# Altium schematic sheet StepperController.SchDoc
size A4
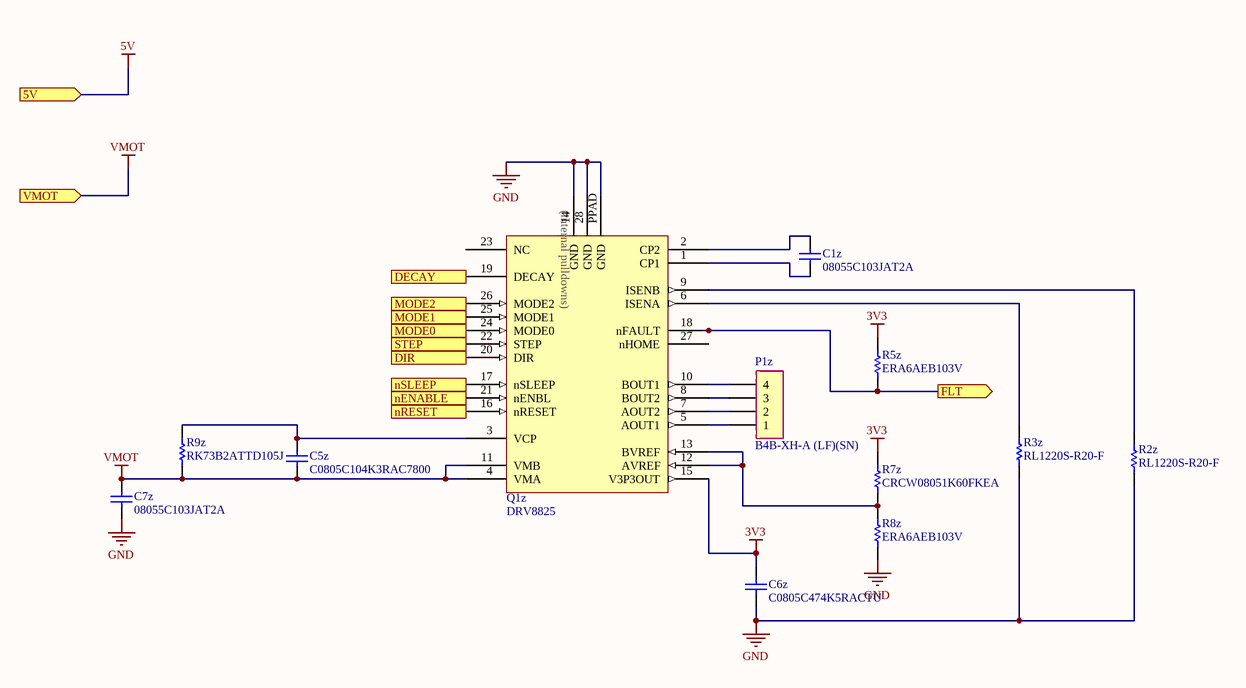
[diagram p0: StepperController.SchDoc]

## Parts
C1z  08055C103JAT2A  [CAPC2013X94X50ML20T25]
C5z  C0805C104K3RAC7800  [CAPC2013X145X50ML20T25]
C6z  C0805C474K5RACTU  [CAPC2013X110X50NL20T25]
C7z  08055C103JAT2A  [CAPC2013X94X50ML20T25]
P1z  B4B-XH-A (LF)(SN)  [B4B-XH-A (LF)(SN)]
Q1z  DRV8825  [DRV8825 HTSSOP]
R2z  RL1220S-R20-F  [RESC2013X50X40ML20T20]
R3z  RL1220S-R20-F  [RESC2013X50X40ML20T20]
R5z  ERA6AEB103V  [RESC2013X60X40ML20T25]
R7z  CRCW08051K60FKEA  [RESC2013X50X30NL20T20]
R8z  ERA6AEB103V  [RESC2013X60X40ML20T25]
R9z  RK73B2ATTD105J  [RESC2013X60X30NL20T20]

## Ports
5V (in), DECAY (in), DIR (in), FLT (out), MODE0 (in), MODE1 (in), MODE2 (in), nENABLE (in), nRESET (in), nSLEEP (in), STEP (in), VMOT (in)

## Nets
3V3: C6z.2 Q1z.15(V3P3OUT) R5z.1 R7z.2
5V: port 5V
GND: C6z.1 C7z.1 Q1z.14(GND) Q1z.28(GND) Q1z.PPAD(GND) R2z.1 R3z.1 R8z.1
VMOT: C5z.2 C7z.2 Q1z.4(VMA) Q1z.11(VMB) R9z.1 ; port VMOT
DECAY: Q1z.19(DECAY) ; port DECAY
DIR: Q1z.20(DIR) ; port DIR
FLT: Q1z.18(nFAULT) R5z.2 ; port FLT
MODE0: Q1z.24(MODE0) ; port MODE0
MODE1: Q1z.25(MODE1) ; port MODE1
MODE2: Q1z.26(MODE2) ; port MODE2
nENABLE: Q1z.21(nENBL) ; port nENABLE
nRESET: Q1z.16(nRESET) ; port nRESET
nSLEEP: Q1z.17(nSLEEP) ; port nSLEEP
STEP: Q1z.22(STEP) ; port STEP
NetC1z_1: C1z.1 Q1z.1(CP1)
NetC1z_2: C1z.2 Q1z.2(CP2)
NetC5z_1: C5z.1 Q1z.3(VCP) R9z.2
NetP1z_1: P1z.1 Q1z.5(AOUT1)
NetP1z_2: P1z.2 Q1z.7(AOUT2)
NetP1z_3: P1z.3 Q1z.8(BOUT2)
NetP1z_4: P1z.4 Q1z.10(BOUT1)
NetQ1z_6: Q1z.6(ISENA) R3z.2
NetQ1z_9: Q1z.9(ISENB) R2z.2
NetQ1z_12: Q1z.12(AVREF) Q1z.13(BVREF) R7z.1 R8z.2

Not connected (* = marked no-connect by the designer): Q1z 23(NC) 27(nHOME)

## Notes on the sheet
- Date:
- Sheet
- of
- Time:
- Revision:
- Drawn by:
- File:
- (in symbol Stepper motor driver DRV8825) (internal pulldowns)

## Library data of the parts
C1z C7z = CMP-2007-04361-1: Manufacturer: AVX Interconnect / Elco; Part Number: 08055C103JAT2A
C5z = CMP-2007-01100-1: Manufacturer: Kemet; Part Number: C0805C104K3RAC7800
C6z = CMP-2007-03659-1: Manufacturer: Kemet; Part Number: C0805C474K5RACTU
P1z = B4B-XH-A (LF)(SN) Wire-to-board connector: Wire-to-board connector, vertical, 2.5mm, 4 contacts
Q1z = Stepper motor driver DRV8825: TI DRV8825 Stepper Motor Controller IC
R2z R3z = CMP-2001-03157-1: Manufacturer: Susumu; Part Number: RL1220S-R20-F
R5z R8z = CMP-2001-00582-1: Manufacturer: Panasonic; Part Number: ERA6AEB103V
R7z = CMP-2001-03618-1: Manufacturer: Vishay Dale; Part Number: CRCW08051K60FKEA
R9z = CMP-2001-04658-1: Manufacturer: KOA Speer; Part Number: RK73B2ATTD105J